# Altium project DL-6-0-0.PrjPCB
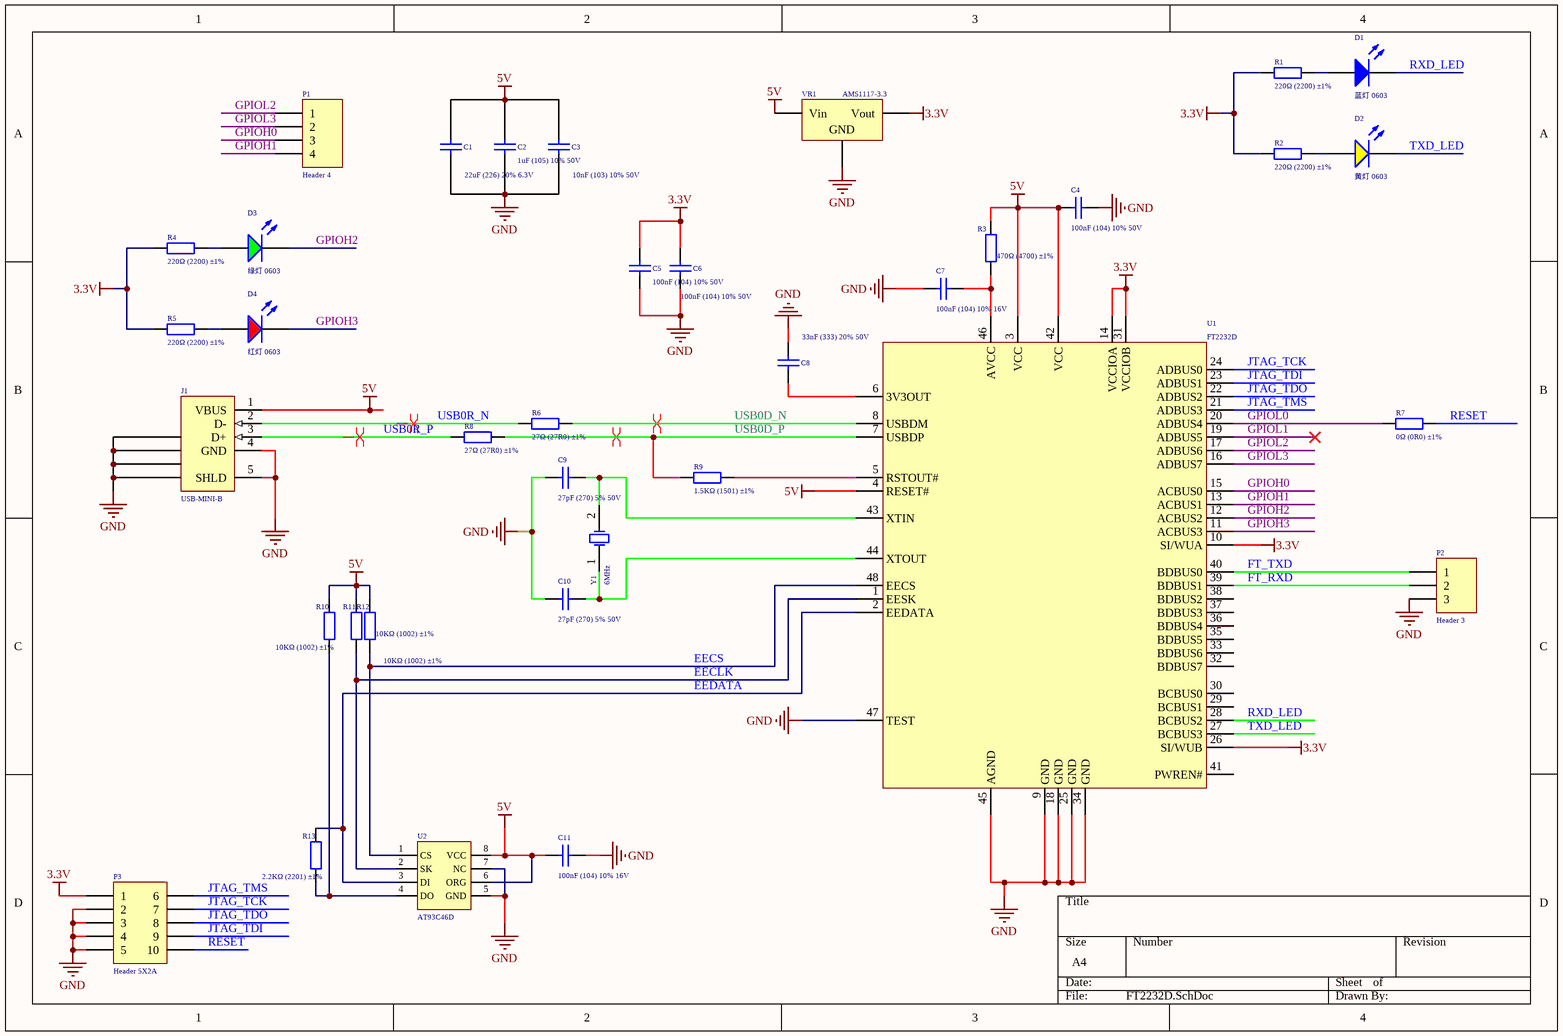
[diagram p0: FT2232D.SchDoc]
1 sheet, 36 parts. Net scope: global (net labels, ports and power ports of the same name join across sheets).
Board file: dl-6-0-0.PcbDoc

## Sheet FT2232D.SchDoc
size A4

### Parts
C1  22uF (226) 20% 6.3V  [0603_C]
C2  1uF (105) 10% 50V  [0603_C]
C3  10nF (103) 10% 50V  [0603_C]
C4  100nF (104) 10% 50V  [0603_C]
C5  100nF (104) 10% 50V  [0603_C]
C6  100nF (104) 10% 50V  [0603_C]
C7  100nF (104) 10% 16V  [0402_C]
C8  33nF (333) 20% 50V  [0402_C]
C9  27pF (270) 5% 50V  [0402_C]
C10  27pF (270) 5% 50V  [0402_C]
C11  100nF (104) 10% 16V  [0402_C]
D1  蓝灯 0603  [0603_LED_S1]
D2  黄灯 0603  [0603_LED_S1]
D3  绿灯 0603  [0603_LED_S1]
D4  红灯 0603  [0603_LED_S1]
J1  USB-MINI-B  [U-G-04WD-W-01 公头]
P1  Header 4  [HDR1X4]
P2  Header 3  [HDR1X3]
P3  Header 5X2A  [SMT HEADER 5*2]
R1  220Ω (2200) ±1%  [0603_R]
R2  220Ω (2200) ±1%  [0603_R]
R3  470Ω (4700) ±1%  [0402_R]
R4  220Ω (2200) ±1%  [0402_R]
R5  220Ω (2200) ±1%  [0402_R]
R6  27Ω (27R0) ±1%  [0603_R]
R7  0Ω (0R0) ±1%  [0402_R]
R8  27Ω (27R0) ±1%  [0603_R]
R9  1.5KΩ (1501) ±1%  [0402_R]
R10  10KΩ (1002) ±1%  [0402_R]
R11  10KΩ (1002) ±1%  [0402_R]
R12  10KΩ (1002) ±1%  [0402_R]
R13  2.2KΩ (2201) ±1%  [0402_R]
U1  FT2232D  [LC-LQFP-48_7x7x05P]
U2  AT93C46D  [LC-SOIC-8_150mil]
VR1  AMS1117-3.3  [SOT-223]
Y1  6MHz  [XTAL-RAD-0.2]

### Nets
3.3V: C5.2 C6.2 P3.1 R1.1 R2.1 R4.1 R5.1 U1.10(SI/WUA) U1.14(VCCIOA) U1.26(SI/WUB) U1.31(VCCIOB) VR1.2(Vout)
5V: C1.1 C2.1 C3.1 C4.1 C11.1 J1.1(VBUS) R3.2 R10.2 R11.2 R12.2 U1.3(VCC) U1.4(RESET#) U1.42(VCC) U2.6(ORG) U2.8(VCC) VR1.3(Vin)
GND: C1.2 C2.2 C3.2 C4.2 C5.1 C6.1 C7.1 C8.2 C9.1 C10.1 C11.2 J1.4(GND) J1.5(SHLD) J1.6(SHLD) J1.7(SHLD) J1.8(SHLD) J1.9(SHLD) P2.3 P3.2 P3.3 P3.4 P3.5 U1.9(GND) U1.18(GND) U1.25(GND) U1.34(GND) U1.45(AGND) U1.47(TEST) U2.5(GND) U2.7(NC) VR1.1(GND)
EECLK: R11.1 U1.1(EESK) U2.2(SK)
EECS: R12.1 U1.48(EECS) U2.1(CS)
EEDATA: R13.2 U1.2(EEDATA) U2.3(DI)
FT_RXD: P2.2 U1.39(BDBUS1)
FT_TXD: P2.1 U1.40(BDBUS0)
GPIOH0: P1.3 U1.15(ACBUS0)
GPIOH1: P1.4 U1.13(ACBUS1)
GPIOH2: D3.K U1.12(ACBUS2)
GPIOH3: D4.K U1.11(ACBUS3)
GPIOL0: R7.1 U1.20(ADBUS4)
GPIOL1: U1.19(ADBUS5)
GPIOL2: P1.1 U1.17(ADBUS6)
GPIOL3: P1.2 U1.16(ADBUS7)
JTAG_TCK: P3.7 U1.24(ADBUS0)
JTAG_TDI: P3.9 U1.23(ADBUS1)
JTAG_TDO: P3.8 U1.22(ADBUS2)
JTAG_TMS: P3.6 U1.21(ADBUS3)
RESET: P3.10 R7.2
RXD_LED: D1.K U1.28(BCBUS2)
TXD_LED: D2.K U1.27(BCBUS3)
USB0D_N: R6.2 U1.8(USBDM)
USB0D_P: R8.2 R9.1 U1.7(USBDP)
USB0R_N: J1.2(D-) R6.1
USB0R_P: J1.3(D+) R8.1
NetC7_2: C7.2 R3.1 U1.46(AVCC)
NetC8_1: C8.1 U1.6(3V3OUT)
NetC9_2: C9.2 U1.43(XTIN) Y1.2(OSC2)
NetC10_2: C10.2 U1.44(XTOUT) Y1.1(OSC1)
NetD1_A: D1.A R1.2
NetD2_A: D2.A R2.2
NetD3_A: D3.A R4.2
NetD4_A: D4.A R5.2
NetR9_2: R9.2 U1.5(RSTOUT#)
NetR10_1: R10.1 R13.1 U2.4(DO)

Not connected (* = marked no-connect by the designer): U1 29(BCBUS1) 30(BCBUS0) 32(BDBUS7) 33(BDBUS6) 35(BDBUS5) 36(BDBUS4) 37(BDBUS3) 38(BDBUS2) 41(PWREN#)

### Layout directives
differential pair: USB0D_N, USB0D_P, USB0R_N, USB0R_P

### Library data of the parts
C1 = 0603 22uF (226) 20% 6.3V: 贴片电容; ComponentLink1Description: 供应商链接; ComponentLink1URL: http://www.szlcsc.com/product/details_60514.html; Package: 0603; Supplier: LC; SuppliersPartNumber: C59461
C2 = 0603 1uF (105) 10% 50V: 贴片电容; ComponentLink1Description: 供应商链接; ComponentLink1URL: http://www.szlcsc.com/product/details_16531.html; Package: 0603; Supplier: LC; SuppliersPartNumber: C15849
C3 = 0603 10nF (103) 10% 50V: 贴片电容; ComponentLink1Description: 供应商链接; ComponentLink1URL: http://www.szlcsc.com/product/details_58143.html; Package: 0603; Supplier: LC; SuppliersPartNumber: C57112
C4-C6 = 0603 100nF (104) 10% 50V: 贴片电容; ComponentLink1Description: 供应商链接; ComponentLink1URL: http://www.szlcsc.com/product/details_15331.html; Package: 0603; Supplier: LC; SuppliersPartNumber: C14663
C7 C11 = 0402 100nF (104) 10% 16V: 贴片电容; ComponentLink1Description: 供应商链接; ComponentLink1URL: http://www.szlcsc.com/product/details_1877.html; Package: 0402; Supplier: LC; SuppliersPartNumber: C1525
C8 = 0402 33nF (333) 20% 50V: 贴片电容; ComponentLink1Description: 供应商链接; ComponentLink1URL: http://www.szlcsc.com/product/details_1937.html; Package: 0402; Supplier: LC; SuppliersPartNumber: C1585
C9 C10 = 0402 27pF (270) 5% 50V: 贴片电容; ComponentLink1Description: 供应商链接; ComponentLink1URL: http://www.szlcsc.com/product/details_1909.html; Package: 0402; Supplier: LC; SuppliersPartNumber: C1557
D1 = 0603 蓝灯: 发光二极管; ComponentLink1Description: 供应商链接; ComponentLink1URL: http://www.szlcsc.com/product/details_73150.html; Package: 0603; Supplier: LC; SuppliersPartNumber: C72041
D2 = 0603 黄灯: 发光二极管; ComponentLink1Description: 供应商链接; ComponentLink1URL: http://www.szlcsc.com/product/details_73147.html; Package: 0603; Supplier: LC; SuppliersPartNumber: C72038
D3 = 0603 绿灯: 发光二极管; ComponentLink1Description: 供应商链接; ComponentLink1URL: http://www.szlcsc.com/product/details_73152.html; Package: 0603; Supplier: LC; SuppliersPartNumber: C72043
D4 = 0603 红灯: 发光二极管; ComponentLink1Description: 供应商链接; ComponentLink1URL: http://www.szlcsc.com/product/details_2659.html; Package: 0603; Supplier: LC; SuppliersPartNumber: C2286
J1 = USB-MINI-B: USB 2.0, Right Angle, SMT, A Type, Receptacle, 5 Position, Black; pin to pad: 6>5 7>6 8>6 9>6; ContactMaterial: Phosphor Bronze; ContactPlating: Gold (30) over Nickel; PCB_Layout: Complies with manufacturer's recommendation.; DrillSize: Corresponds to nominal value.; PanelGround: Without; Published: 15-Jul-2004; DatasheetDocument: 15-Nov-2002; PackageDocument: 15-Nov-2002; PackageReference: 440478; Publisher: Altium Limited; HousingMaterial: Thermoplastic; ComponentLink1Description: Manufacturer Link; ComponentLink1URL: http://www.tycoelectronics.com/; ComponentLink2Description: Packaging Specification; ComponentLink2URL: http://ecommas.tycoelectronics.com/commerce/DocumentDelivery/DDEController?Action=showdoc&DocId=Customer+Drawing%7F440478%7FB%7Fpdf%7FEnglish%7FC_440478_B.pdf
P1 = Header 4: Header, 4-Pin; LatestRevisionDate: 17-Jul-2002; LatestRevisionNote: Re-released for DXP Platform.; Publisher: Altium Limited
P2 = Header 3: Header, 3-Pin; LatestRevisionDate: 17-Jul-2002; LatestRevisionNote: Re-released for DXP Platform.; Publisher: Altium Limited
P3 = Header 5X2A: Header, 5-Pin, Dual row; LatestRevisionDate: 17-Jul-2002; LatestRevisionNote: Re-released for DXP Platform.; Publisher: Altium Limited
R1 R2 = 0603 220Ω (2200) 1%: 贴片电阻; ComponentLink1Description: 供应商链接; ComponentLink1URL: http://www.szlcsc.com/product/details_23689.html; Package: 0603; Supplier: LC; SuppliersPartNumber: C22962
R3 = 0402 470Ω (4700) 1%: 贴片电阻; ComponentLink1Description: 供应商链接; ComponentLink1URL: http://www.szlcsc.com/product/details_25860.html; Package: 0402; Supplier: LC; SuppliersPartNumber: C25117
R4 R5 = 0402 220Ω (2200) 1%: 贴片电阻; ComponentLink1Description: 供应商链接; ComponentLink1URL: http://www.szlcsc.com/product/details_25834.html; Package: 0402; Supplier: LC; SuppliersPartNumber: C25091
R6 R8 = 0603 27Ω (27R0) 1%: 贴片电阻; ComponentLink1Description: 供应商链接; ComponentLink1URL: http://www.szlcsc.com/product/details_25933.html; Package: 0603; Supplier: LC; SuppliersPartNumber: C25190
R7 = 0402 0Ω (0R0) 1%: 贴片电阻; ComponentLink1Description: 供应商链接; ComponentLink1URL: http://www.szlcsc.com/product/details_17853.html; Package: 0402; Supplier: LC; SuppliersPartNumber: C17168
R9 = 0402 1.5KΩ (1501) 1%: 贴片电阻; ComponentLink1Description: 供应商链接; ComponentLink1URL: http://www.szlcsc.com/product/details_26610.html; Package: 0402; Supplier: LC; SuppliersPartNumber: C25867
R10-R12 = 0402 10KΩ (1002) 1%: 贴片电阻; ComponentLink1Description: 供应商链接; ComponentLink1URL: http://www.szlcsc.com/product/details_26487.html; Package: 0402; Supplier: LC; SuppliersPartNumber: C25744
R13 = 0402 2.2KΩ (2201) 1%: 贴片电阻; ComponentLink1Description: 供应商链接; ComponentLink1URL: http://www.szlcsc.com/product/details_26622.html; Package: 0402; Supplier: LC; SuppliersPartNumber: C25879
VR1 = SOT-223 AMS1117-3.3: 低压差线性稳压(LDO); ComponentLink1Description: 供应商链接; ComponentLink1URL: http://www.szlcsc.com/product/details_6652.html; Package: SOT-223; Supplier: LC; SuppliersPartNumber: C6186
Y1 = XTAL: 晶体振荡器; Published: 8-Jun-2000; LatestRevisionDate: 17-Jul-2002; LatestRevisionNote: Re-released for DXP Platform.; PackageReference: R38; Publisher: Altium Limited